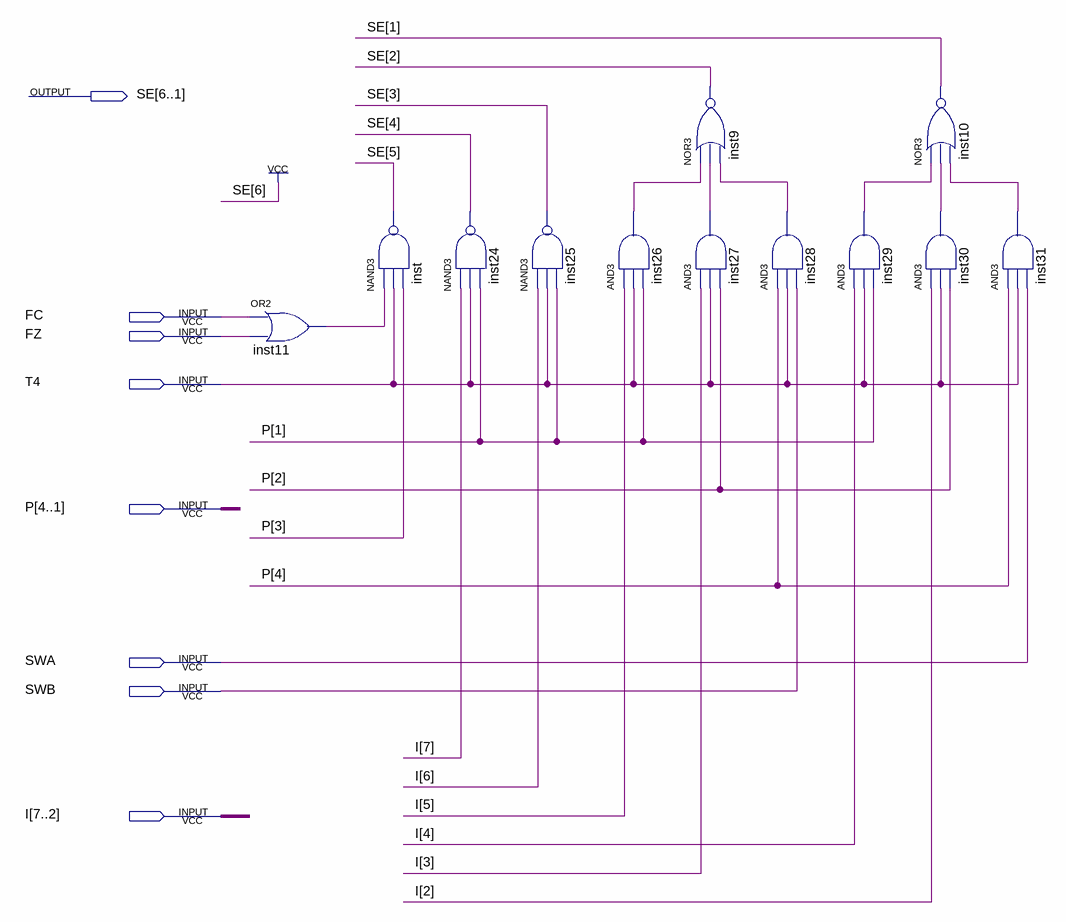
[diagram p0: schematic sheet]
// Quartus schematic uControl.bdf as structural Verilog: 12 symbols, 8 pins
module uControl (
  input  FC,
  input  FZ,
  input  T4,
  input  [4:1] P,
  input  SWA,
  input  SWB,
  input  [7:2] I,
  output [6:1] SE
);

  wire inst11_out, inst26_out, inst27_out, inst28_out, inst29_out, inst30_out, inst31_out;

  or inst11 (inst11_out, FC, FZ);
  nand inst (SE[5], inst11_out, T4, P[3]);
  nand inst24 (SE[4], I[7], T4, P[1]);
  nand inst25 (SE[3], I[6], T4, P[1]);
  and inst26 (inst26_out, I[5], T4, P[1]);
  nor inst9 (SE[2], inst26_out, inst27_out, inst28_out);
  and inst27 (inst27_out, I[3], T4, P[2]);
  and inst28 (inst28_out, P[4], T4, SWB);
  and inst29 (inst29_out, I[4], T4, P[1]);
  nor inst10 (SE[1], inst29_out, inst30_out, inst31_out);
  and inst30 (inst30_out, I[2], T4, P[2]);
  and inst31 (inst31_out, P[4], T4, SWA);

  assign SE[6] = 1'b1;
endmodule
